# EasyEDA Pro project Type_C硬盘盒_2025-09-27_14-32-02.eprj, board PCB1_1
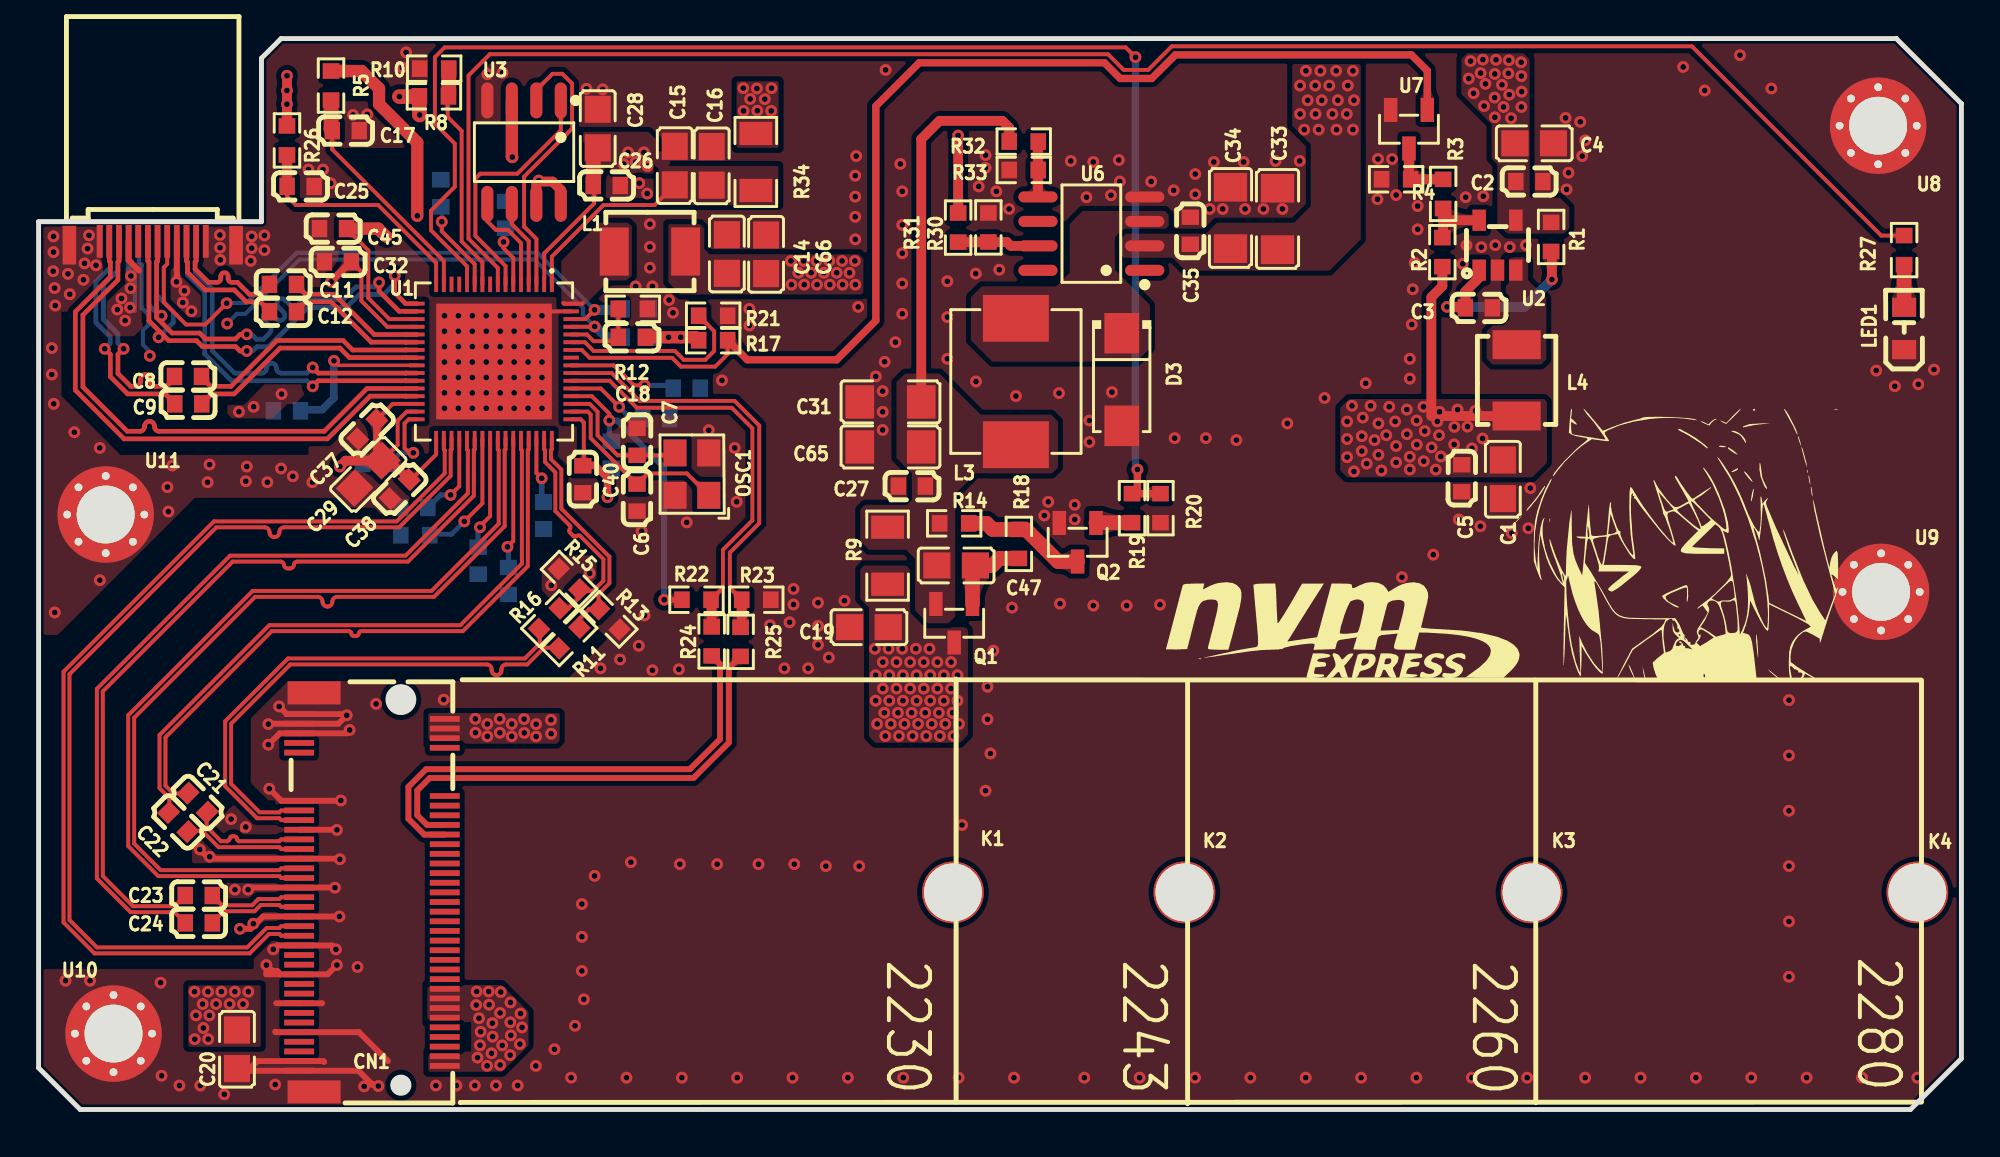
[diagram p4: board, top side]
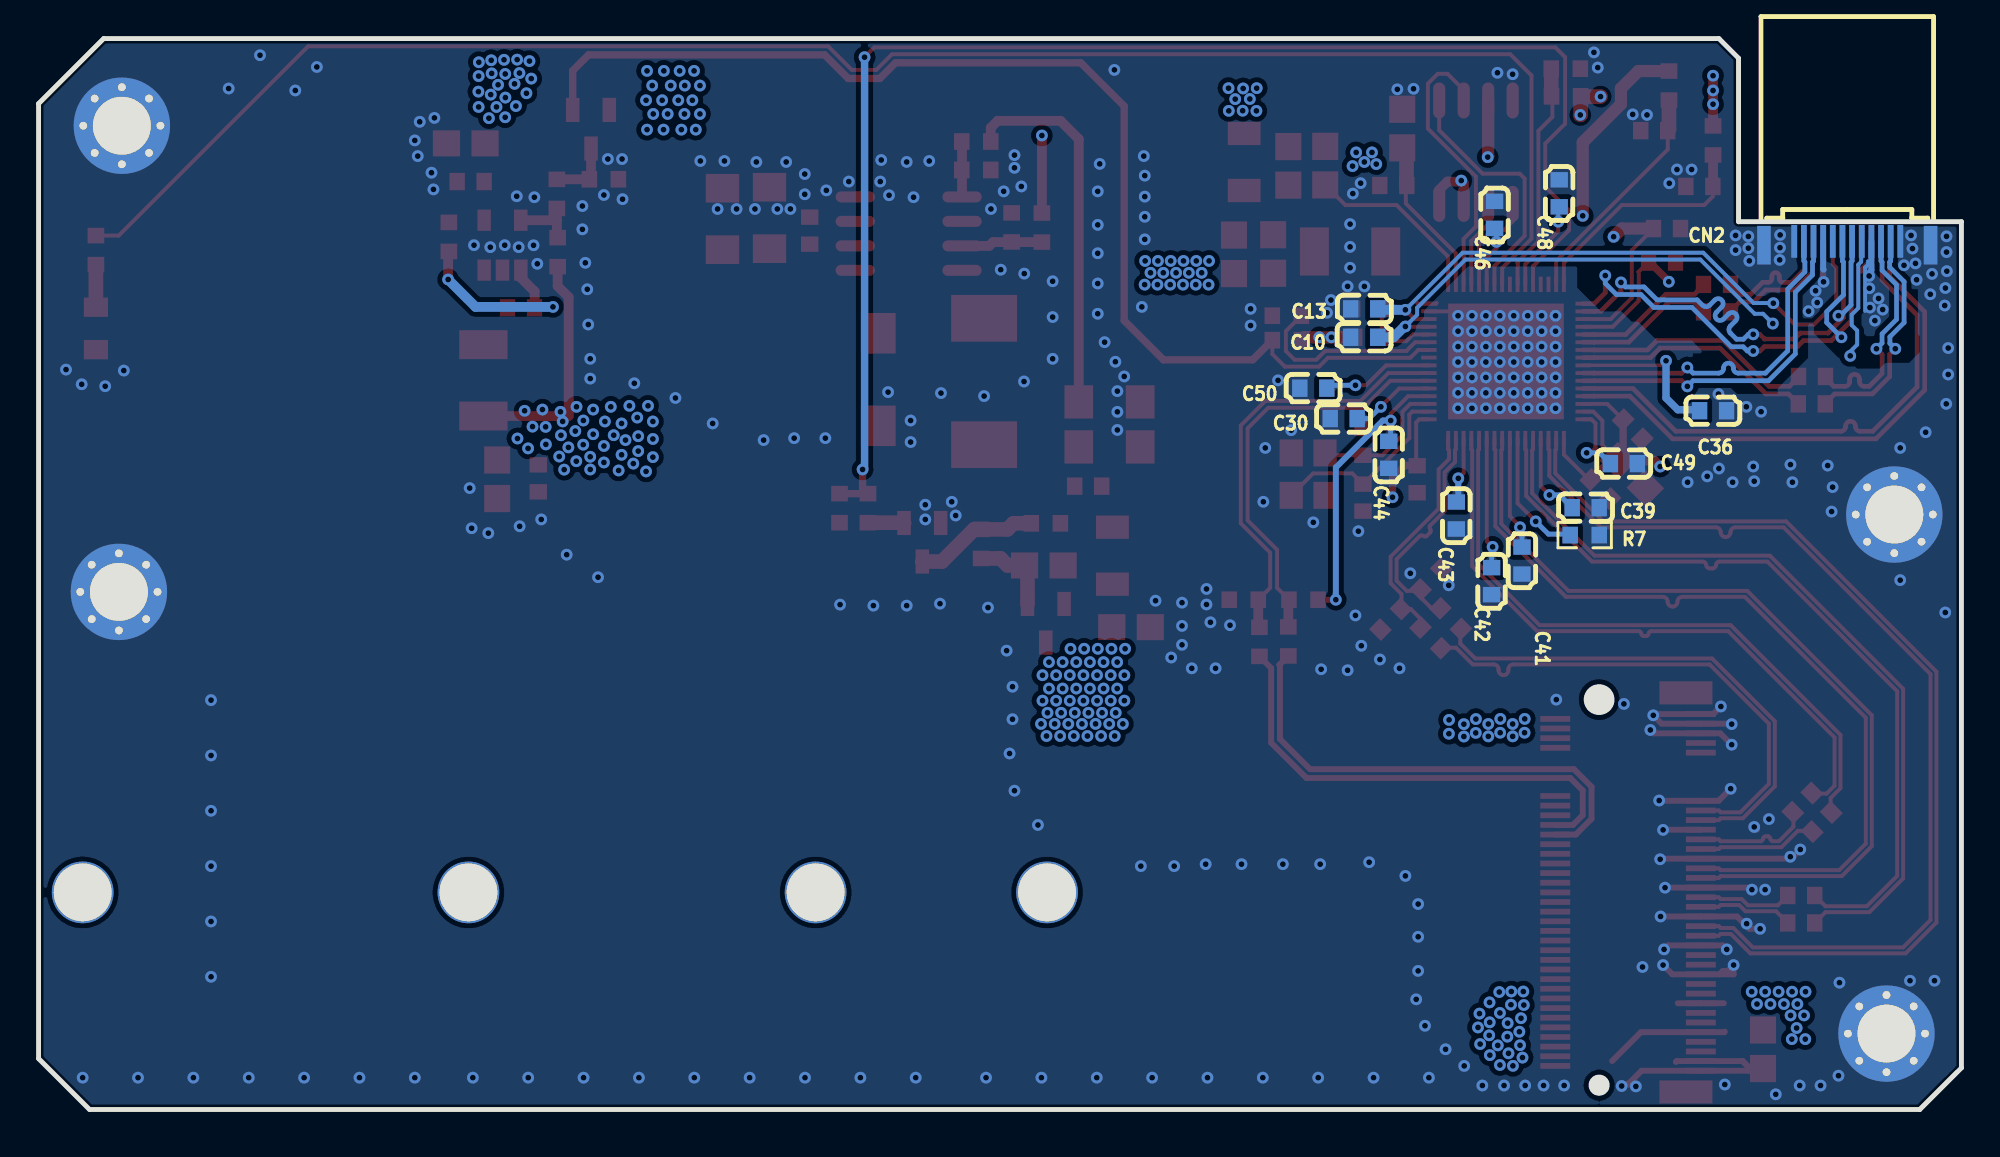
[diagram p5: board, bottom side, seen from below]

Outline 99.69 x 55.55 mm; copper layers: Top Layer, Inner1, Inner2, Bottom Layer. Coordinates in mm from the lower left corner of the outline.
Outline path: 0,46.05 11.56,46.05 11.56,54.53 12.57,55.55 96.32,55.55 99.69,52.17 99.69,2.64 97.05,0 2.16,0 0,2.16 0,46.05
Stack: Top Layer 0.035mm / Dielectric1 0.28mm PP er 4.5 / Inner1 0.035mm / Dielectric2 0.28mm FR4 er 4.5 / Inner2 0.035mm / Dielectric3 0.28mm PP er 4.5 / Bottom Layer 0.035mm

## Design rules (mm)
net REF_CLKP: REFCLK
net REF_CLKN: REFCLK
net $1N30478: MM2TX0
net $1N30420: MM2TX0
net P_RXP0: M2RX0
net P_RXN0: M2RX0
net $1N31175: MM2TX1
net $1N31117: MM2TX1
net P_RXP1: M2RX1
net P_RXN1: M2RX1
net U_RXP1: U3RX1
net U_RXN1: U3RX1
net DM: U2
net DP: U2
net $1N13574: TU3TX2
net $1N13608: TU3TX2
net $1N14258: TU3TX1
net $1N14292: TU3TX1
net U_RXN2: U3RX2
net U_RXP2: U3RX2
net CLKP: CLK
net CLKN: CLK
net P_TXP0: M2TX0
net P_TXN0: M2TX0
net P_TXP1: M2TX1
net P_TXN1: M2TX1
net U_TXP2: U3TX2
net U_TXN2: U3TX2
net U_TXN1: U3TX1
net U_TXP1: U3TX1
spacing safeClearance (default): track to track 0.152, other pairs 0.152 to 0.152
track width trackWidth (default): min 0.127, default 0.254, max 2.54
differential pair U3 (default): width min 0.241, default 0.241, max 0.241; gap min 0.152, default 0.152
differential pair M.2: width min 0.206, default 0.206, max 0.206; gap min 0.102, default 0.102
via viaSize (default): diameter min 0.5, default 0.61, max 10; hole min 0.3, default 0.305, max 6
net REF_CLKP uses M.2
net REF_CLKN uses M.2
net $1N30478 uses M.2
net $1N30420 uses M.2
net P_RXP0 uses M.2
net P_RXN0 uses M.2
net $1N31175 uses M.2
net $1N31117 uses M.2
net P_RXP1 uses M.2
net P_RXN1 uses M.2
net CLKP uses M.2
net CLKN uses M.2
net P_TXP0 uses M.2
net P_TXN0 uses M.2
net P_TXP1 uses M.2
net P_TXN1 uses M.2
diff pair REFCLK uses M.2
diff pair MM2TX0 uses M.2
diff pair M2RX0 uses M.2
diff pair MM2TX1 uses M.2
diff pair M2RX1 uses M.2
diff pair CLK uses M.2
diff pair M2TX0 uses M.2
diff pair M2TX1 uses M.2

## Placement (name value [footprint] x y rotation side)
C1  100nF  [C0805]  75.92 32.69 90 top
C2  104  [C0603]  77.29 48.13 0 top
C3  1uF  [C0603]  74.68 41.58 180 top
C4  100nF  [C0805]  77.55 50.11 180 top
C5  104  [C0603]  73.79 32.74 270 top
C6  33pF  [C0603]  31.03 31.74 90 top
C7  33pF  [C0603]  31.03 34.63 270 top
C8  104  [C0603]  7.75 38.02 0 top
C9  104  [C0603]  7.76 36.6 0 top
C10  330pF  [C0603]  30.96 40.06 180 bottom
C11  104  [C0603]  12.67 42.8 180 top
C12  104  [C0603]  12.67 41.38 180 top
C13  330pF  [C0603]  30.96 41.53 0 bottom
C14  100nF  [C0805]  35.69 44.37 270 top
C15  100nF  [C0805]  32.99 48.96 270 top
C16  100nF  [C0805]  34.9 48.95 270 top
C17  1uF  [C0603]  15.93 50.77 0 top
C18  1uF  [C0603]  30.76 40.06 180 top
C19  100nF  [C0805]  43.05 25.02 0 top
C20  100nF  [C0805]  10.29 3.12 90 top
C21  220nF  [C0603]  8.25 15.92 315 top
C22  220nF  [C0603]  7.24 14.91 315 top
C23  220nF  [C0603]  8.31 11.1 0 top
C24  220nF  [C0603]  8.31 9.68 0 top
C25  1uF  [C0603]  13.59 47.88 0 top
C26  104  [C0603]  29.46 47.93 0 top
C27  104  [C0603]  45.28 32.33 180 top
C28  100nF  [C0805]  28.99 50.88 270 top
C29  100nF  [C0805]  17.09 32.94 225 top
C30  104  [C0603]  32.03 35.84 180 bottom
C31  100uF  [C1206]  44.17 36.7 0 top
C32  104  [C0603]  15.52 43.97 180 top
C33  100uF  [C1206]  64.24 46.19 270 top
C34  100uF  [C1206]  61.8 46.24 270 top
C35  104  [C0603]  59.71 45.58 90 top
C36  104  [C0603]  12.88 36.25 180 bottom
C37  104  [C0603]  17.04 35.28 45 top
C38  104  [C0603]  18.72 32.18 225 top
C39  104  [C0603]  19.48 31.22 180 bottom
C40  104  [C0603]  28.22 32.69 270 top
C41  104  [C0603]  22.78 28.47 90 bottom
C42  104  [C0603]  24.36 27.41 90 bottom
C43  1uF  [C0603]  26.19 30.81 90 bottom
C44  104  [C0603]  29.69 33.96 90 bottom
C45  1uF  [C0603]  15.27 45.69 180 top
C46  104  [C0603]  24.21 46.41 90 bottom
C47  NC  [C0805]  47.57 28.22 180 top
C48  104  [C0603]  20.85 47.52 90 bottom
C49  104  [C0603]  17.5 33.5 180 bottom
C50  104  [C0603]  33.6 37.41 180 bottom
C65  100uF  [C1206]  44.17 34.37 0 top
C66  100nF  [C0805]  37.72 44.36 270 top
CN1  91302-32-067RDM  [CONN-SMD_91302-32-067RDM]  17.28 11.26 90 top
CN2  USB-307HE-B-SU  [USB-TYPE-C-SMD_USB-307HE-B-SU]  5.92 44.93 0 bottom
D3  SS54  [SMA_L4.3-W2.7-LS5.1-RD]  56.16 37.86 270 top
K1  -  [M3无外边]  47.41 11.26 0 top
K2  -  [M3无外边]  59.41 11.26 0 top
K3  -  [M3无外边]  77.41 11.26 0 top
K4  -  [M3无外边]  97.41 11.26 0 top
L1  4.7uH  [IND-SMD_L4.5-W4.0-1]  31.7 44.51 180 top
L3  1uH  [IND-SMD_L7.3-W6.6]  50.67 37.76 90 top
L4  4.7uH  [IND-SMD_L4.5-W4.0-1]  76.63 37.82 270 top
LED1  led0805  [LED0805-RD]  96.72 40.51 90 top
OSC1  25MHZ  [OSC-SMD_4P-L3.2-W2.5-BL]  33.87 32.96 90 top
Q1  NC  [SOT-23-3_L2.9-W1.3-P1.90-LS2.4-BR]  47.47 25.22 90 top
Q2  NC  [SOT-23-3_L2.9-W1.3-P1.90-LS2.4-BR]  53.87 29.42 90 top
R1  510K  [R0603]  78.42 45.26 90 top
R2  510K  [R0603]  72.78 44.47 90 top
R3  510K  [R0603]  72.82 47.49 90 top
R4  510K  [R0603]  70.39 48.25 180 top
R5  510K  [R0603]  15.16 53.11 90 top
R7  510K  [R0603]  19.53 29.79 180 bottom
R8  510K  [R0603]  20.5 52.55 180 top
R9  0  [R1206]  44.02 28.73 270 top
R10  510K  [R0603]  20.51 53.99 0 top
R11  510K  [R0603]  27.51 24.46 45 top
R12  510K  [R0603]  30.81 41.53 180 top
R13  510K  [R0603]  29.59 25.43 135 top
R14  NC  [R0603]  47.47 30.4 180 top
R15  510K  [R0603]  27.5 27.51 315 top
R16  510K  [R0603]  26.48 25.46 45 top
R17  510K  [R0603]  34.98 39.9 180 top
R18  NC  [R0603]  50.83 29.34 90 top
R19  NC  [R0603]  56.69 31.19 270 top
R20  NC  [R0603]  58.17 31.19 90 top
R21  510K  [R0603]  34.98 41.17 0 top
R22  510K  [R0603]  34.11 26.44 180 top
R23  510K  [R0603]  37.21 26.44 180 top
R24  510K  [R0603]  34.9 24.28 270 top
R25  510K  [R0603]  36.4 24.26 270 top
R26  510K  [R0603]  12.88 50.27 270 top
R27  510K  [R0603]  96.72 44.58 90 top
R30  100K  [R0603]  49.24 45.75 270 top
R31  100K  [R0603]  47.68 45.75 90 top
R32  6.2K  [R0603]  51.08 50.21 180 top
R33  3.6K  [R0603]  51.08 48.73 0 top
R34  NC  [R1206]  37.19 49.15 270 top
U1  JMS583  [QFN-64_L8.0-W8.0-P0.40-TL-EP6.0]  23.61 38.8 270 top
U2  RY3430  [TSOT-23-5_L2.9-W1.6-P0.95-LS2.8-BR]  75.64 44.83 270 top
U3  MX25L512EMI-10G  [SOP-8_L4.9-W3.9-P1.27-LS6.0-BL]  25.17 49.66 180 top
U6  TD1583  [SOP-8_L5.0-W4.0-P1.27-LS6.0-BL]  54.58 45.43 90 top
U7  NC  [SOT-23-3_L2.9-W1.3-P0.95-LS2.4-BR]  71.05 50.85 90 top
U8  -  [M3]  95.38 51.03 0 top
U9  -  [M3]  95.53 26.85 0 top
U10  -  [M3]  3.89 3.94 0 top
U11  -  [M3]  3.48 30.86 0 top

## Footprints (pads in the part's own frame, mm; a bottom-side part is the same pattern mirrored in y, then rotated)
C0603
  rect 0.8x0.9 smd: 1(-0.7,0) 2(0.7,0)
C0805
  rect 1.41x1.35 smd: 1(-1,0) 2(1,0)
C1206
  rect 1.486x1.727 smd: 1(-1.593,0) 2(1.593,0)
CONN-SMD_91302-32-067RDM
  rect 0.3x1.55 smd: 1(-9.25,3.775) 2(-9,-3.775) 3(-8.75,3.775) 4(-8.5,-3.775) 5(-8.25,3.775) 6(-8,-3.775) 7(-7.75,3.775) 8(-7.5,-3.775) 9(-7.25,3.775) 10(-7,-3.775) 11(-6.75,3.775) 12(-6.5,-3.775) 13(-6.25,3.775) 14(-6,-3.775) 15(-5.75,3.775) 16(-5.5,-3.775) 17(-5.25,3.775) 18(-5,-3.775) 19(-4.75,3.775) 20(-4.5,-3.775) 21(-4.25,3.775) 22(-4,-3.775) 23(-3.75,3.775) 24(-3.5,-3.775) 25(-3.25,3.775) 26(-3,-3.775) 27(-2.75,3.775) 28(-2.5,-3.775) 29(-2.25,3.775) 30(-2,-3.775) 31(-1.75,3.775) 32(-1.5,-3.775) 33(-1.25,3.775) 34(-1,-3.775) 35(-0.75,3.775) 36(-0.5,-3.775) 37(-0.25,3.775) 38(0,-3.775) 39(0.25,3.775) 40(0.5,-3.775) 41(0.75,3.775) 42(1,-3.775) 43(1.25,3.775) 44(1.5,-3.775) 45(1.75,3.775) 46(2,-3.775) 47(2.25,3.775) 48(2.5,-3.775) 49(2.75,3.775) 50(3,-3.775) 51(3.25,3.775) 52(3.5,-3.775) 53(3.75,3.775) 54(4,-3.775) 55(4.25,3.775) 56(4.5,-3.775) 57(4.75,3.775) 58(5,-3.775) 67(7.25,3.775) 68(7.5,-3.775) 69(7.75,3.775) 70(8,-3.775) 71(8.25,3.775) 72(8.5,-3.775) 73(8.75,3.775) 74(9,-3.775) 75(9.25,3.775)
  rect 1.2x2.75 smd: 76(-10.35,3) 76(10.35,3)
IND-SMD_L4.5-W4.0-1
  rect 1.5x2.5 smd: 1(-1.85,0) 2(1.85,0)
IND-SMD_L7.3-W6.6
  rect 2.424x3.42 smd: 1(3.278,0) 2(-3.278,0)
LED0805-RD
  rect 1x1.25 smd: 1(-1.1,0) 2(1.1,0)
M3
  round 0.6 hole 0.405x0.4: 1(-2,0) 1(-1.41,1.41) 1(-1.41,-1.41) 1(0,2) 1(0,-2) 1(1.41,1.41) 1(1.41,-1.41) 1(2,0)
  round 5 hole 3.005x3: 1(0,0)
M3无外边
  round 3.2 hole 3: 1(0,0)
OSC-SMD_4P-L3.2-W2.5-BL
  rect 1.4x1.2 smd: 1(-1.1,-0.875) 2(1.1,-0.875) 3(1.1,0.875) 4(-1.1,0.875)
QFN-64_L8.0-W8.0-P0.40-TL-EP6.0
  rect 0.8x0.2 smd: 1(-4,3) 2(-4,2.6) 3(-4,2.2) 4(-4,1.8) 5(-4,1.4) 6(-4,1) 7(-4,0.6) 8(-4,0.2) 9(-4,-0.2) 10(-4,-0.6) 11(-4,-1) 12(-4,-1.4) 13(-4,-1.8) 14(-4,-2.2) 15(-4,-2.6) 16(-4,-3) 33(4,-3) 34(4,-2.6) 35(4,-2.2) 36(4,-1.8) 37(4,-1.4) 38(4,-1) 39(4,-0.6) 40(4,-0.2) 41(4,0.2) 42(4,0.6) 43(4,1) 44(4,1.4) 45(4,1.8) 46(4,2.2) 47(4,2.6) 48(4,3)
  rect 0.2x0.8 smd: 17(-3,-4) 18(-2.6,-4) 19(-2.2,-4) 20(-1.8,-4) 21(-1.4,-4) 22(-1,-4) 23(-0.6,-4) 24(-0.2,-4) 25(0.2,-4) 26(0.6,-4) 27(1,-4) 28(1.4,-4) 29(1.8,-4) 30(2.2,-4) 31(2.6,-4) 32(3,-4) 49(3,4) 50(2.6,4) 51(2.2,4) 52(1.8,4) 53(1.4,4) 54(1,4) 55(0.6,4) 56(0.2,4) 57(-0.2,4) 58(-0.6,4) 59(-1,4) 60(-1.4,4) 61(-1.8,4) 62(-2.2,4) 63(-2.6,4) 64(-3,4)
  rect 6x6 smd: 65(0,0)
R0603
  rect 0.806x0.864 smd: 1(-0.753,0) 2(0.753,0)
R1206
  rect 1.208x1.701 smd: 1(-1.479,0) 2(1.479,0)
SMA_L4.3-W2.7-LS5.1-RD
  rect 2.1x1.801 smd: 1(-2.401,0) 2(2.401,0)
SOP-8_L4.9-W3.9-P1.27-LS6.0-BL
  oval 0.63x1.865 smd: 1(-1.905,-2.683) 2(-0.635,-2.683) 3(0.635,-2.683) 4(1.905,-2.683) 5(1.905,2.683) 6(0.635,2.683) 7(-0.635,2.683) 8(-1.905,2.683)
SOP-8_L5.0-W4.0-P1.27-LS6.0-BL
  oval 0.574x2.035 smd: 1(-1.905,-2.768) 2(-0.635,-2.768) 3(0.635,-2.768) 4(1.905,-2.768) 5(1.905,2.768) 6(0.635,2.768) 7(-0.635,2.768) 8(-1.905,2.768)
SOT-23-3_L2.9-W1.3-P0.95-LS2.4-BR
  rect 1.25x0.7 smd: 1(1,-0.95) 2(1,0.95) 3(-1,0)
SOT-23-3_L2.9-W1.3-P1.90-LS2.4-BR
  rect 1.25x0.7 smd: 1(1,-0.95) 2(1,0.95) 3(-1,0)
TSOT-23-5_L2.9-W1.6-P0.95-LS2.8-BR
  rect 1.1x0.7 smd: 1(1.294,-0.951) 2(1.294,-0.001) 3(1.294,0.951) 4(-1.294,0.951) 5(-1.294,-0.949)
USB-TYPE-C-SMD_USB-307HE-B-SU
  rect 0.299x1.7 smd far side: A1(2.751,-0.099) A2(2.251,-0.099) A3(1.75,-0.099) A4(1.25,-0.099) A5(0.752,-0.099) A6(0.252,-0.099) A7(-0.249,-0.099) A8(-0.75,-0.099) A9(-1.25,-0.099) A10(-1.75,-0.099) A11(-2.251,-0.099) A12(-2.748,-0.099)
  rect 0.299x1.7 smd: B1(-2.748,-0.099) B2(-2.251,-0.099) B3(-1.75,-0.099) B4(-1.25,-0.099) B5(-0.75,-0.099) B6(-0.249,-0.099) B7(0.252,-0.099) B8(0.752,-0.099) B9(1.25,-0.099) B10(1.75,-0.099) B11(2.251,-0.099) B12(2.751,-0.099)
  rect 0.701x1.999 smd: SH1(4.321,0.099) SH2(-4.321,0.099)
  rect 0.701x1.999 smd far side: SH3(-4.321,0.099) SH4(4.321,0.099)

## Nets
As in the schematic.

Pads without a net: CN1 5 6 7 8 10 11 13 17 19 20 22 23 24 25 26 28 30 32 34 36 38 40 42 44 46 48 54 56 58 67 68 69; CN2 A8 B8; K1 1; K2 1; K3 1; K4 1; U6 1 6 8

## Via types
v1: diameter 0.61, hole 0.305, Top Layer to Bottom Layer, 616 vias

## Routing (per net, layer and track width the routed paths; a pad name or vN(x,y) marks a point on that pad's centre or on a via; arc(x,y) is an arc through that point)
+1V: length 85.9
  Top Layer w0.178: U1.25 15.55,38.6 v1(15.32,38.84)
  Top Layer w0.203: v1(26.09,32.74) 25.81,33.02 U1.46 ; C29.1 18.62,34.47 18.62,35.73 19.08,36.2 U1.31 ; U1.40 23.41,30.78 22.89,30.25 v1(22.89,30.2) ; C40.1 28.27,33.44 28.27,35.64 28.11,35.8 U1.49 ; U1.20 18.08,40.6 16.74,41.94 16.74,43.45 C32.1 ; U1.53 29.15,37.4 v1(30.1,36.45) ; v1(21.36,31.88) 21.81,32.33 U1.36 ; U1.43 24.61,29.49 v1(24.31,29.18) ; 26.22,43.03 26.22,44.41 28.81,47 28.81,47.95 ; U1.30 18.36,36.6 C37.2 ; U1.33 20.61,33.97 19.32,32.68 C38.1
  Top Layer w0.381: 15.17,42.93 v1(15.17,42.94) 15.17,42.96 16.2,43.99 ; 28.21,33.41 28.84,33.41 29.5,32.76 v1(29.5,31.76) ; C38.1 18.24,33.65 C29.1 ; 17.75,33.71 17.54,33.91 C37.2
  Top Layer w0.508: 17.8,33.66 15.93,33.66 v1(15.62,33.35) ; R2.1 72.78,42.71 72.21,42.14 72.21,35.97 L4.2 ; C29.1 17.75,33.71
  Top Layer w0.762: 28.77,47.98 28.77,49.8 28.92,49.95
  Inner2 w0.508: v1(15.32,38.84) 15.17,38.98 v1(15.17,42.94)
  Bottom Layer w0.254: v1(30.1,36.45) 30.71,35.84 C30.2 ; v1(21.36,31.88) 20.84,31.88 C39.1 ; v1(22.89,30.2) 22.78,30.1 C41.2 ; C42.2 24.36,29.13 v1(24.31,29.18)
  Bottom Layer w0.305: v1(26.09,32.74) 26.09,31.61 C43.2
  Bottom Layer w0.381: C36.1 13.63,36.3 14.71,36.3 15.32,36.91 v1(15.32,38.84)
  vias: v1(30.34,49.04) v1(30.56,49.65) v1(30.96,49.15) v1(31.38,49.65) v1(31.57,48.93) v1(39.01,44.02) v1(39.03,42.79) v1(39.39,43.4) v1(39.67,44.02) v1(39.7,42.79) v1(40.06,43.4) v1(40.33,44.02) v1(40.36,42.79) v1(40.72,43.4) v1(41,44.02) v1(41.02,42.79) v1(41.38,43.4) v1(41.66,44.02) v1(41.69,42.79) v1(42.04,43.4) v1(42.32,44.02) v1(42.35,42.79) v1(67.84,35.69) v1(67.84,34.78) v1(67.84,33.84) v1(68.1,36.5) v1(68.2,33.1) v1(68.66,35.89) v1(68.61,34.93) v1(68.61,34.15) v1(68.86,33.5) v1(69.06,36.5) v1(69.27,34.72) v1(69.47,35.59) v1(69.47,33.96) v1(69.62,33.15) v1(69.88,34.98) v1(70.03,36.45) v1(70.33,35.69) v1(70.38,34.42) v1(70.38,33.56) v1(70.94,36.31) v1(70.94,35.03) v1(71.09,33.86) v1(71.09,33.2) v1(71.45,35.74) v1(71.46,34.48) v1(71.81,36.45) v1(71.87,35.19) v1(71.82,33.63) v1(72.23,34.34) v1(72.44,33.19) v1(72.52,35.69) v1(72.64,36.19) v1(72.61,34.97) v1(72.7,33.87) v1(73.41,35.41) v1(73.39,34.5) v1(73.57,36.31) v1(74.09,35.42) v1(74.32,34.29) v1(74.5,36.24) v1(74.87,34.81)
+3.3V: length 19.5
  Top Layer w0.508: R32.2 50.33,50.93 49.97,51.28 46.71,51.28 45.76,50.34 C31.2
AVDD33: length 61.9
  Top Layer w0.203: v1(24.11,45) 24.11,44.68 24.61,44.17 U1.6 ; v1(19.43,34.06) 19.23,34.06 18.97,34.32 18.97,35.59 19.19,35.8 U1.32 ; v1(29.59,35.74) 29.59,36.09 28.69,37 U1.52 ; U1.19 18.18,41 17.09,42.09 17.09,44.57 C45.1 ; U1.11 22.61,43.84 20.9,45.55 v1(20.9,46.05) ; U1.56 29.83,38.6 30.86,37.57 v1(31.42,37.57)
  Top Layer w0.305: R22.2 v1(32.44,26.44)
  Top Layer w0.508: U3.8 27.08,47.7 26.64,48.13 25.98,48.13 v1(25.93,48.18) 25.81,48.06 U3.7
  Top Layer w0.635: v1(19.63,46.36) 19.63,50.17 17.65,52.15 17.65,52.96 16.75,53.87 R5.2 ; C45.1 17.61,45.69 v1(18.03,45.27) ; U3.3 24.54,49.43 v1(24.56,49.4) ; C18.1 v1(32.66,40.06) v1(33.29,40.06) 34.07,40.06 R17.2
  Bottom Layer w0.203: v1(20.9,46.05) 20.9,46.77 C48.1
  Bottom Layer w0.254: v1(29.59,35.74) 29.59,34.76 C44.2 ; C50.2 32.75,37.57 v1(31.42,37.57) ; C46.1 24.11,45.61 v1(24.11,45) ; v1(19.43,34.06) 18.76,34.06 C49.1
  Bottom Layer w0.305: v1(32.44,26.44) 32.44,33.3 30,35.74 v1(29.59,35.74)
GND: length 70.6
  Top Layer w0.203: U1.63 26.21,41.4 U1.65
  Top Layer w0.305: v1(15.42,8.31) 15.21,8.51 CN1.27 12.37,8.51 v1(12.17,8.31) ; v1(8.36,13.49) 8.83,13.01 CN1.45 15.59,13.01 v1(15.62,12.98) ; 12.27,4.04 12.3,4.01 CN1.9 16.61,4.01 18.11,2.51 ; 10.93,2.1 10.94,2.1 11.35,2.51 ; 10.93,2.1 11.34,2.51 11.35,2.51 ; 10.93,2.1 11.01,2.01 CN1.1 16.58,2.01 17.3,1.3 ; v1(11.91,18.92) 12.5,19.51 CN1.71 15.95,19.51 v1(16.13,19.69) ; v1(15.47,14.5) 15.46,14.51 CN1.51 ; v1(11.96,16.64) 12.59,16.01 CN1.57 15.66,16.01 v1(15.67,16.03) ; 12.55,7.01 CN1.21 14.99,7.01 v1(15.47,7.49) ; 12.55,7.01 12.37,7.19 12.12,7.19 v1(11.81,7.49) 11.81,7.01 12.55,7.01 ; v1(10.74,14.66) 10.6,14.51 ; 15.62,10.03 v1(15.6,10.01) CN1.33 11.64,10.01 11,9.37 v1(10.44,9.37) ; v1(16.88,1.2) 16.98,1.3 17.3,1.3 ; 17.3,1.3 17.3,1.35 ; 12.32,5.51 CN1.15 14.71,5.51 ; v1(10.86,11.4) 10.97,11.51 CN1.39 15.36,11.51 v1(15.37,11.51) ; v1(12.47,20.9) 12.86,20.51 15.91,20.51 v1(15.98,20.45) 15.54,20.01 CN1.73 11.93,20.01 v1(11.91,19.99) ; 11.35,2.51 CN1.3 14.76,2.51 14.81,2.46
  vias: v1(0.76,43.48) v1(0.69,39.5) v1(0.69,38.13) v1(0.77,45.29) v1(0.77,44.47) v1(0.83,42.61) v1(0.86,41.7) v1(0.79,36.6) v1(0.84,25.78) v1(1.4,6.68) v1(1.52,43.34) v1(1.62,42.29) v1(1.85,35.13) v1(2.33,43.04) v1(2.38,43.89) v1(2.54,44.66) v1(2.61,45.34) v1(2.67,6.68) v1(2.98,43.79) v1(3.17,34.32) v1(3.17,27.46) v1(6.32,6.58) v1(6.38,1.75) v1(6.68,32.28) v1(6.73,31.01) v1(6.93,33.4) v1(7.3,1.24) v1(8.39,1.24) v1(8.76,32.54) v1(8.86,33.45) v1(8.87,13.11) v1(9.4,45.36) v1(9.41,44.7) v1(9.42,44.07) v1(9.63,0.79) v1(9.98,15.06) v1(10.18,11.4) v1(10.39,36.2) v1(10.74,32.59) v1(10.8,33.35) v1(11.05,45.29) v1(11.05,44.68) v1(11,44.02) v1(11.15,36.45) v1(11.14,9.64) v1(11.71,45.34) v1(11.71,44.58) v1(11.86,32.54) v1(12.27,1.3) v1(12.6,37.11) v1(12.57,33.25) v1(13.18,32.84) v1(13.99,48.76) v1(14.2,32.54) v1(14.75,48.76) v1(15.15,48.04) v1(16.3,51.59) v1(16.54,7.39) v1(17.04,51.62) v1(17.5,21.04) v1(17.62,1.22) v1(18.86,54.05) v1(19.05,54.83) v1(20.6,1.24) v1(21.04,41.17) v1(21.04,40.37) v1(21.04,39.57) v1(21.04,38.77) v1(21.04,37.97) v1(21.04,37.17) v1(21.04,36.37) v1(21.01,21.26) v1(21.67,1.24) v1(21.77,41.17) v1(21.77,40.37) v1(21.77,39.57) v1(21.77,38.77) v1(21.77,37.97) v1(21.77,37.17) v1(21.77,36.37) v1(22.49,41.17) v1(22.49,40.37) v1(22.49,39.57) v1(22.49,38.77) v1(22.49,37.97) v1(22.49,37.17) v1(22.49,36.37) v1(22.62,1.24) v1(23.21,41.17) v1(23.21,40.37) v1(23.21,39.57) v1(23.21,38.77) v1(23.21,37.97) v1(23.21,37.17) v1(23.21,36.37) v1(23.27,53.7) v1(23.71,1.24) v1(23.93,41.17) v1(23.93,40.37) v1(23.93,39.57) v1(23.93,38.77) v1(23.93,37.97) v1(23.93,37.17) v1(23.93,36.37) v1(24.06,53.78) v1(24.66,41.17) v1(24.66,40.37) v1(24.66,39.57) v1(24.66,38.77) v1(24.66,37.97) v1(24.66,37.17) v1(24.66,36.37) v1(24.84,1.24) v1(25.38,41.17) v1(25.38,40.37) v1(25.38,39.57) v1(25.38,38.77) v1(25.38,37.97) v1(25.38,37.17) v1(25.38,36.37) v1(25.78,2.26) v1(26.1,41.17) v1(26.1,40.37) v1(26.1,39.57) v1(26.1,38.77) v1(26.1,37.97) v1(26.1,37.17) v1(26.1,36.37) v1(26.58,27.19) v1(26.75,3.12) v1(27.61,1.65) v1(27.81,4.34) v1(28.17,10.66) v1(28.17,8.96) v1(28.17,7.19) v1(28.27,5.72) v1(28.41,52.94) v1(28.58,27.81) v1(28.83,12.12) v1(29.13,22.89) v1(29.25,52.92) v1(30.15,23.34) v1(30.48,1.65) v1(30.71,12.83) v1(30.95,42.69) v1(31.15,48.05) v1(31.11,24.05) v1(31.27,30) v1(31.42,25.63) v1(31.55,47.51) v1(31.7,45.93) v1(31.7,44.74) v1(31.7,43.66) v1(31.83,42.7) v1(31.83,22.78) v1(32.69,41.99) v1(32.89,41.33) v1(33.2,22.83) v1(33.25,12.73) v1(33.35,1.65) v1(33.6,30.45) v1(34.75,35.24) v1(35.18,12.73) v1(35.43,37.82) v1(36.09,34.32) v1(36.19,31.52) v1(36.22,1.65) v1(36.86,41.53) v1(36.86,40.67) v1(37.33,12.73) v1(37.92,25.12) v1(38.67,22.89) v1(38.94,25.27) v1(39.14,27) v1(39.14,26.19) v1(39.09,1.65) v1(39.18,12.73) v1(39.9,22.89) v1(40.41,26.29) v1(40.41,25.08) v1(40.41,24.1) v1(40.82,12.62) v1(40.97,23.44) v1(41.78,26.39) v1(41.96,1.65) v1(42.34,48.44) v1(42.34,47.35) v1(42.34,46.3) v1(42.34,45.14) v1(42.39,49.45) v1(42.49,41.63) v1(42.55,12.62) v1(43.41,38.02) v1(43.76,37.26) v1(43.76,36.19) v1(43.76,35.25) v1(43.87,38.79) v1(43.92,53.92) v1(44.42,39.8) v1(44.68,49.05) v1(44.78,47.62) v1(44.78,45.89) v1(44.78,44.41) v1(44.78,42.84) v1(44.78,41.28) v1(44.83,1.65) v1(47.12,42.96) v1(47.12,41.1) v1(47.12,38.94) v1(47.7,1.65) v1(47.88,14.76) v1(48.59,43.36) v1(48.6,37.76) v1(48.74,47.88) v1(49.1,49.51) v1(49.1,48.84) v1(49.1,16.54) v1(49.2,21.93) v1(49.2,20.24) v1(49.35,18.47) v1(49.5,23.8) v1(49.66,47.62) v1(49.81,43.56) v1(50.32,46.71) v1(50.47,26.04) v1(50.57,1.65) v1(50.67,37.01) v1(52.15,30.81) v1(52.35,31.52) v1(52.91,37.16) v1(52.96,26.24) v1(53.52,49.2) v1(53.72,31.37) v1(53.72,30.61) v1(54.22,1.65) v1(54.33,47.32) v1(54.48,35.74) v1(54.48,34.62) v1(54.69,49.15) v1(54.69,26.14) v1(55.6,47.42) v1(55.65,37.21) v1(56.01,49.25) v1(56.06,48.13) v1(56.41,26.14) v1(57.09,1.65) v1(57.69,48.13) v1(58.14,26.19) v1(58.85,47.68) v1(58.9,34.82) v1(59.96,1.65) v1(59.97,48.52) v1(59.97,47.47) v1(60.52,34.82) v1(60.72,46.71) v1(60.93,49.15) v1(61.39,46.71) v1(62.1,34.72) v1(62.48,49.15) v1(62.55,46.71) v1(62.83,1.65) v1(63.51,46.71) v1(64.13,49.2) v1(64.49,46.71) v1(64.74,35.59) v1(65.38,49.2) v1(65.7,1.65) v1(66.68,36.91) v1(68.57,1.65) v1(68.81,37.67) v1(69.44,49.3) v1(69.42,47.22) v1(70.18,49.3) v1(70.39,47.43) v1(70.69,27.61) v1(71.09,38.94) v1(71.09,37.91) v1(71.25,42.55) v1(71.2,40.72) v1(71.35,43.92) v1(71.44,1.65) v1(71.5,46.86) v1(71.5,45.66) v1(72.31,28.78) v1(73.63,30.61) v1(73.84,43.87) v1(73.99,47.32) v1(74.03,44.83) v1(74.31,1.65) v1(74.75,30.25) v1(74.8,44.73) v1(74.9,47.37) v1(75.53,44.83) v1(76.28,44.73) v1(76.38,29.9) v1(77.12,44.83) v1(77.24,30.15) v1(77.18,1.65) v1(77.34,32.23) v1(79.17,51.44) v1(79.22,47.73) v1(79.32,48.59) v1(79.93,51.23) v1(80.04,49.45) v1(80.19,50.27) v1(80.19,1.65) v1(83.06,1.65) v1(85.27,54.08) v1(85.93,1.65) v1(86.39,52.86) v1(88.21,54.69) v1(88.8,1.65) v1(89.84,52.96) v1(90.75,21.23) v1(90.75,18.36) v1(90.75,15.49) v1(90.75,12.62) v1(90.75,9.75) v1(90.75,6.88) v1(91.67,1.65) v1(94.54,1.65) v1(95.28,38.33) v1(96.24,37.52) v1(97.46,37.62) v1(97.41,1.65) v1(98.27,38.38)
VBUS_IN: length 12.4
  Top Layer w0.203: C25.1 12.89,47.36 13.33,46.91 17.61,46.91 20.61,43.91 U1.16
  Top Layer w0.508: C25.1 12.88,47.89 R26.2
VDDREG: length 9.4
  Top Layer w0.203: U1.1 26.61,44.24 29.29,46.91 31.94,46.91 C15.2
CC1: length 31.7
  Top Layer w0.203: U1.62 28.35,41 v1(28.83,41.48) ; CN2.A5 6.67,43.86 6.49,43.68 6.49,41.87 7.65,40.72 8.65,40.72 v1(9.75,41.82)
  Bottom Layer w0.203: v1(28.83,41.48) 25.86,44.44 13.39,44.44 10.78,41.83 9.76,41.83 v1(9.75,41.82)
  Bottom Layer w0.508: C13.1 30.21,41.48 v1(28.83,41.48)
CC2: length 35.9
  Top Layer w0.203: U1.61 28.81,40.6 v1(28.83,40.61)
  Inner2 w0.203: v1(5.77,39.09) 6.73,39.09 7.75,40.11 9.12,40.11 v1(9.78,40.77)
  Bottom Layer w0.203: 5.2,44.86 5.2,43.97 5.34,43.83 5.35,43.8 5.35,41.57 5.69,41.23 5.69,40.69 5.41,40.4 5.41,39.67 5.77,39.31 v1(5.77,39.09) ; v1(9.78,40.77) 10.29,41.28 10.72,41.28 13.53,44.09 25.72,44.09 28.22,41.59 28.22,41.22 v1(28.83,40.61)
  Bottom Layer w0.508: C10.2 29.44,40.06 28.88,40.61 v1(28.83,40.61)
CLKN: length 12.1
  Top Layer w0.205: U1.47 26.21,34.25 26.26,34.2 26.26,33.58 26.79,33.05 26.79,31.04 27.54,30.29 arc(27.58,30.2) 27.54,30.11 arc(27.51,30.02) 27.54,29.93 27.72,29.75 arc(27.81,29.71) 27.9,29.75 arc(27.99,29.79) 28.08,29.75 29.29,28.55 29.29,27.43 28.76,26.9 28.12,26.9 28.04,26.98 28.04,26.56 27.47,25.99 27.02,25.99
CLKP: length 12
  Top Layer w0.205: R11.2 28.04,25.45 28.55,25.96 R13.2 29.03,25.98 29.03,26.74 29.59,27.3 29.59,28.67 27.1,31.17 27.1,33.2 26.57,33.73 26.57,34.2 26.61,34.25 U1.48
DM: length 27.3
  Top Layer w0.241: U1.17 19.04,41.8 19.04,41.8 18.47,42.37 v1(18.47,43.26) ; CN2.A7 5.67,44.01 5.72,43.96 5.72,40.91 6.75,39.88 8.19,39.88 8.49,39.57 10.21,39.57 10.44,39.34 v1(10.8,39.34)
  Bottom Layer w0.241: v1(18.47,43.26) 18.47,42.85 17.89,42.27 16.62,42.27 15.95,41.6 13.97,41.6 11.93,39.56 11.32,39.56 11.1,39.34 v1(10.8,39.34) ; v1(6.22,40.06) 6.98,40.82 6.98,41.38 6.12,42.25 6.12,43.96 6.17,44.01 CN2.B7
DP: length 27.2
  Top Layer w0.241: U1.18 19.04,41.4 19.04,41.4 18.7,41.4 17.65,42.45 v1(17.65,42.9) ; v1(10.8,40.21) 10.45,40.21 10.21,39.97 8.66,39.97 8.35,40.28 6.92,40.28 6.12,41.08 6.12,43.96 6.17,44.01 CN2.A6
  Bottom Layer w0.241: v1(10.8,40.21) 11.05,40.21 11.3,39.95 11.66,39.95 11.98,40.28 arc(12.06,40.46) 11.98,40.64 11.71,40.91 arc(11.71,41.27) 12.07,41.27 12.34,41 arc(12.7,41) 12.7,41.36 12.43,41.63 arc(12.43,41.99) 12.79,41.99 13.06,41.71 arc(13.24,41.64) 13.42,41.71 13.7,42 15.78,42 16.45,42.67 17.42,42.67 v1(17.65,42.9) ; v1(6.38,41.17) 6.27,41.17 5.72,41.72 5.72,43.96 5.67,44.01 CN2.B6
GPIO0: length 14.7
  Top Layer w0.203: U3.2 25.81,52.88 26.64,53.72 27.15,53.72 27.66,53.21 27.66,50.88 25.17,48.39 25.17,45.8 25.81,45.16 U1.3
GPIO1: length 4.5
  Top Layer w0.203: U1.4 25.41,45.05 24.54,45.92 U3.6
GPIO2: length 5.3
  Top Layer w0.203: U1.5 25.01,44.95 24.33,45.63 23.71,45.63 23.27,46.07 U3.5
GPIO3: length 13.1
  Top Layer w0.203: U1.7 24.21,43.75 22.65,45.32 22.65,48.29 22.9,48.54 24.82,48.54 27.08,50.8 U3.1
GPIO4: length 91.3
  Top Layer w0.203: R27.2 95.54,45.33 85.72,55.15 58.76,55.15 57.53,53.92 56.26,53.92 55.45,54.74 23.39,54.74 22.29,53.63 22.29,45.17 23.81,43.65 U1.8
GPIO6: length 11.9
  Top Layer w0.203: U1.10 23.01,43.95 21.94,45.02 21.94,50.76 21.21,51.49 21.21,52.51
  Top Layer w0.762: R10.2 21.27,52.57 R8.1
GPIO7: length 74.5
  Top Layer w0.203: U1.12 22.21,43.74 20.34,45.61 20.34,46.62 21.58,47.86 21.58,50.1 20.55,51.13 20.55,54.58 21.06,55.09 56.36,55.09 v1(56.87,54.58)
  Top Layer w0.381: v1(56.97,33.2) 56.97,32.22 56.69,31.94 58.17,31.94
  Bottom Layer w0.381: v1(56.97,33.2) 56.87,33.3 v1(56.87,54.58)
LXO: length 1
  Top Layer w0.203: 27.2,41.83 27.24,41.8 U1.64 28.18,41.8 28.22,41.83
M.2+3.3V:
  vias: v1(8.08,6.11) v1(8.16,4.88) v1(8.1,3.65) v1(8.51,5.47) v1(8.55,4.23) v1(8.78,6.11) v1(8.86,4.88) v1(8.79,3.65) v1(9.2,5.47) v1(9.48,6.11) v1(9.9,5.47) v1(10.18,6.11) v1(10.6,5.47) v1(10.87,6.11) v1(22.64,20.26) v1(22.65,19.54) v1(22.72,6.12) v1(22.69,5.42) v1(22.76,2.69) v1(22.83,4.74) v1(22.92,4.03) v1(22.89,3.33) v1(23.27,20) v1(23.27,19.36) v1(23.25,2.27) v1(23.34,6.12) v1(23.36,5.44) v1(23.53,4.48) v1(23.54,3.78) v1(23.48,2.91) v1(23.91,20.26) v1(23.92,19.54) v1(23.96,6.09) v1(23.93,5.01) v1(23.93,2.31) v1(24.04,3.33) v1(24.47,5.56) v1(24.46,4.52) v1(24.45,2.82) v1(24.53,20) v1(24.53,19.36) v1(24.48,3.85) v1(24.95,3.39) v1(24.99,4.97) v1(25.06,4.26) v1(25.17,20.25) v1(25.18,19.53) v1(25.8,19.99) v1(25.8,19.35) v1(26.57,20.21) v1(26.57,19.49) v1(43.36,23.9) v1(43.4,22.53) v1(43.4,21.21) v1(43.48,20) v1(43.77,23.21) v1(43.77,21.83) v1(43.85,20.58) v1(43.9,19.37) v1(44.07,23.9) v1(44.11,22.53) v1(44.11,21.21) v1(44.18,20) v1(44.48,23.21) v1(44.48,21.83) v1(44.56,20.58) v1(44.61,19.37) v1(44.78,23.9) v1(44.81,22.53) v1(44.81,21.21) v1(44.89,20) v1(45.19,23.21) v1(45.19,21.83) v1(45.26,20.58) v1(45.31,19.37) v1(45.48,23.9) v1(45.52,22.53) v1(45.52,21.21) v1(45.6,20) v1(45.89,23.21) v1(45.89,21.83) v1(45.97,20.58) v1(46.02,19.37) v1(46.19,23.9) v1(46.23,22.53) v1(46.23,21.21) v1(46.31,20) v1(46.6,23.21) v1(46.6,21.83) v1(46.68,20.58) v1(46.73,19.37) v1(46.94,22.53) v1(46.94,21.21) v1(47.01,20) v1(47.31,23.21) v1(47.31,21.83) v1(47.39,20.58) v1(47.44,19.37) v1(47.64,22.53) v1(47.64,21.21) v1(47.72,20)
MODE0: length 62.3
  Top Layer w0.203: R17.1 35.73,39.18 35.08,38.53 33.3,38.53 32.85,38.99 28.57,38.99 28.16,39.4 U1.58
  Top Layer w0.381: R17.1 36.75,38.89 41.38,38.89 43.41,40.92 43.41,52.04 45.66,54.29 55.26,54.29 56.08,53.48 57.72,53.48 58.94,54.7 71.18,54.7 72,53.88 U7.1
MODE1: length 10.1
  Top Layer w0.203: U1.59 28.32,39.8 28.78,39.34 32.99,39.34 33.45,38.89 34.57,38.89 35.03,39.34 35.03,40.37 R21.1
P_RXN0: length 44.1
  Top Layer w0.205: CN1.41 12.58,12.01 12.48,12.11 6.2,12.11 4.65,13.66 4.65,20.45 11.1,26.9 20.38,26.9 23.86,30.38 23.86,34.2 23.81,34.25 U1.41
P_RXN1: length 52.2
  Top Layer w0.205: CN1.29 12.58,9.01 12.48,9.11 11.95,9.11 10.94,8.1 2.9,8.1 1.3,9.7 1.3,22.71 9.09,30.51 18.57,30.51 21.06,33 21.06,34.2 21.01,34.25 U1.34
P_RXP0: length 44.2
  Top Layer w0.205: U1.42 24.21,34.25 24.17,34.2 24.17,30.25 20.5,26.59 15.48,26.59 arc(15.31,26.52) 15.23,26.34 arc(15.16,26.16) 14.98,26.09 ; CN1.43 12.58,12.51 12.48,12.41 6.33,12.41 4.96,13.79 4.96,20.32 11.23,26.59 14.47,26.59 arc(14.65,26.52) 14.72,26.34 arc(14.8,26.16) 14.98,26.09
P_RXP1: length 52.3
  Top Layer w0.205: U1.35 21.41,34.25 21.37,34.2 21.37,32.87 18.69,30.2 12.73,30.2 arc(12.56,30.12) 12.48,29.95 arc(12.41,29.77) 12.23,29.69 ; CN1.31 12.58,9.51 12.48,9.41 11.82,9.41 10.82,8.41 3.02,8.41 1.6,9.83 1.6,22.58 9.22,30.2 11.72,30.2 arc(11.9,30.12) 11.97,29.95 arc(12.05,29.77) 12.23,29.69
P_TXN0: length 33.2
  Top Layer w0.205: C22.1 6.78,15.44 6.78,16.16 6.27,16.67 6.27,19.43 11.96,25.12 21.87,25.12 25.06,28.31 25.06,34.2 25.01,34.25 U1.44
P_TXN1: length 41.7
  Top Layer w0.205: C24.1 7.05,10.23 4.77,10.23 3.02,11.99 3.02,21.82 9.93,28.73 19.02,28.73 22.26,31.96 22.26,34.2 22.21,34.25 U1.37
P_TXP0: length 33.3
  Top Layer w0.205: C21.1 7.72,16.38 6.99,16.38 6.58,16.8 6.58,19.3 12.09,24.81 16.09,24.81 arc(16.18,24.78) 16.22,24.69 arc(16.25,24.6) 16.34,24.56 16.47,24.56 arc(16.56,24.6) 16.6,24.69 arc(16.64,24.78) 16.73,24.81 22,24.81 25.37,28.18 25.37,34.2 25.41,34.25 U1.45
P_TXP1: length 41.6
  Top Layer w0.205: C23.1 7.05,10.54 4.9,10.54 3.33,12.11 3.33,21.69 10.06,28.42 12.55,28.42 arc(12.67,28.37) 12.72,28.24 arc(12.78,28.12) 12.9,28.07 13.06,28.07 arc(13.18,28.12) 13.23,28.24 arc(13.28,28.37) 13.41,28.42 19.15,28.42 22.57,31.83 22.57,34.2 22.61,34.25 U1.38
PCIE_CLKREQ: length 22.3
  Top Layer w0.203: R23.2 35.84,27.06 35.84,28.89 37.36,30.41 37.36,35.48 36.09,36.75 31.16,36.75 29.72,38.2 U1.55
  Top Layer w0.508: R25.1 36.46,25.07 R23.2
PCIE_RST: length 21.6
  Top Layer w0.203: R22.1 35.48,27.06 35.48,29.03 37.01,30.56 37.01,35.33 35.94,36.4 31.01,36.4 29.61,37.8 U1.54
  Top Layer w0.508: R22.1 34.9,26.41 R24.1
REF_CLKN: length 26.7
  Top Layer w0.205: CN1.53 12.58,15.01 12.48,15.11 11.33,15.11 9.67,16.76 9.67,20.14 12.93,23.39 25.21,23.39 25.98,24.17 25.98,24.9 25.95,24.93
REF_CLKP: length 26.6
  Top Layer w0.205: R11.1 26.95,23.95 26.2,23.95 25.34,23.09 24.25,23.09 arc(24.07,23.01) 24,22.83 24,22.78 arc(23.74,22.53) 23.49,22.78 23.49,22.83 arc(23.42,23.01) 23.24,23.09 13.06,23.09 9.98,20.01 9.98,16.89 11.46,15.41 12.48,15.41 12.58,15.51 CN1.55
RST: length 12
  Top Layer w0.203: C17.1 15.23,49.8 21.01,44.01 U1.15
  Top Layer w0.762: C17.1 15.16,50.84 R5.1
TME: length 4.3
  Top Layer w0.203: R12.2 30.06,40.06 ; 30.06,40.06 C18.2 29.86,39.85 28.78,39.85 28.43,40.2 U1.60 ; 30.06,40.06 29.92,40.2
U_RXN1: length 18.1
  Top Layer w0.241: U1.27 19.04,37.8 19.04,37.8 14.5,37.8 v1(14.21,37.51)
  Bottom Layer w0.241: 7.67,45.03 7.67,44.01 7.72,43.96 7.72,43.28 8.61,42.39 8.61,39.19 10,37.8 13.92,37.8 v1(14.21,37.51)
U_RXN2: length 28.1
  Top Layer w0.241: CN2.A10 4.17,44.01 4.11,43.96 4.11,43.03 2.3,41.21 2.3,37.48 4.6,35.18 5.24,35.18 arc(5.42,35.25) 5.5,35.43 5.5,35.44 arc(5.75,35.7) 6,35.44 6,35.43 arc(6.08,35.25) 6.26,35.18 14.81,35.18 17.03,37.4 19.04,37.4 19.04,37.4 U1.28
U_RXP1: length 18
  Top Layer w0.241: U1.26 19.04,38.2 19.04,38.2 14.5,38.2 v1(14.21,38.49)
  Bottom Layer w0.241: CN2.B11 8.17,44.01 8.12,43.96 8.12,43.45 9.01,42.56 9.01,39.35 10.16,38.2 11.57,38.2 arc(11.75,38.27) 11.82,38.45 11.82,38.46 arc(12.08,38.71) 12.33,38.46 12.33,38.45 arc(12.41,38.27) 12.59,38.2 13.92,38.2 v1(14.21,38.49)
U_RXP2: length 28.2
  Top Layer w0.241: U1.29 19.04,37 19.04,37 17.19,37 14.97,34.79 4.43,34.79 1.91,37.31 1.91,41.38 3.72,43.19 3.72,43.96 3.67,44.01 CN2.A11
U_TXN1: length 7.3
  Top Layer w0.241: U1.22 19.04,39.8 19.04,39.8 17.25,39.8 15.16,41.89 13.85,41.89 13.37,41.42 C12.1
U_TXN2: length 12.6
  Top Layer w0.241: C8.2 8.45,37.98 8.92,37.51 9.98,37.51 12.36,39.89 15.79,39.89 16.28,39.4 19.04,39.4 19.04,39.4 U1.23
U_TXP1: length 7.3
  Top Layer w0.241: U1.21 19.04,40.2 19.04,40.2 17.41,40.2 15.32,42.29 13.85,42.29 13.37,42.76 C11.1
U_TXP2: length 12.6
  Top Layer w0.241: C9.2 8.97,37.12 10.14,37.12 12.52,39.5 15.62,39.5 16.12,39 19.04,39 19.04,39 U1.24
USB5V: length 17.8
  Top Layer w0.305: 7.19,43.26 7.17,43.28 CN2.A4 ; CN2.A9 4.67,44.05 5.21,43.51
  Top Layer w0.508: R31.2 v1(47.68,50.52) ; v1(12.88,53.62) v1(12.88,52.86) v1(12.88,52.15) R26.1
  Top Layer w0.762: v1(19.76,51.59) 19.74,51.6 R8.2 19.73,52.54 v1(18.71,52.54)
  Bottom Layer w0.203: 4.84,44 4.84,43.82 4.99,43.67 4.99,41.42
  Bottom Layer w0.305: 7.14,43.56 7.17,43.59 CN2.A4 ; 4.7,43.51 4.67,43.54 CN2.A9
  vias: v1(4.08,41.49) v1(4.3,42.07) v1(4.49,40.92) v1(4.74,41.6) v1(4.79,43.24) v1(4.77,42.6) v1(7.15,42.93) v1(7.56,42.47) v1(7.48,41.86) v1(7.92,41.41) v1(36.54,52.98) v1(36.55,51.8) v1(36.89,52.42) v1(37.24,52.96) v1(37.27,51.81) v1(37.65,52.41) v1(38,52.98) v1(37.99,51.8) v1(65.41,53.11) v1(65.41,51.64) v1(65.62,50.83) v1(65.71,53.87) v1(65.8,52.35) v1(66.19,53.11) v1(66.21,51.64) v1(66.37,50.83) v1(66.46,53.87) v1(66.53,52.35) v1(66.92,53.11) v1(67.08,51.64) v1(67.28,53.87) v1(67.36,52.35) v1(67.29,50.83) v1(67.83,51.64) v1(67.88,53.11) v1(68.15,53.87) v1(68.15,50.83) v1(68.2,52.35) v1(74.15,53.47) v1(74.24,54.38) v1(74.4,52.71) v1(74.76,53.76) v1(74.88,54.46) v1(74.95,52.05) v1(75.02,53.2) v1(75.56,54.45) v1(75.5,53.71) v1(75.49,52.49) v1(75.5,51.47) v1(75.87,53.15) v1(75.96,52) v1(76.23,54.42) v1(76.2,53.74) v1(76.25,52.64) v1(76.35,51.42) v1(76.87,54.32) v1(76.88,53.6) v1(76.89,52.8) v1(76.88,52)
XIN: length 10.1
  Top Layer w0.203: U1.50 28.47,36.2 28.63,36.05 28.63,34.82 31.01,32.44 C6.2 31.58,32.99 33.61,32.99 OSC1.1
XOUT: length 7.3
  Top Layer w0.203: OSC1.3 32.87,33.93 C7.2 30.02,33.93 28.98,34.97 28.98,36.2 28.58,36.6 U1.51
$1N4207: length 4.2
  Top Layer w0.508: U6.7 50.4,44.8 50.21,44.99 R31.1
$1N4210: length 2.9
  Top Layer w0.508: U6.5 51.82,50.19 R32.1
$1N6130: length 3.3
  Top Layer w0.508: U7.3 71.05,48.34 R4.1 72.82,48.25 R3.2
$1N6159: length 3.4
  Top Layer w0.508: R2.2 72.82,45.27 72.82,46.1 ; 72.82,46.1 R3.1 ; 72.82,46.1 72.85,46.13 U2.5
$1N7264: length 6.5
  Top Layer w0.762: Q2.3 52.86,28.42 51.19,30.09 R18.2 49.46,30.09 49.15,30.4 R14.1
$1N7265: length 4.5
  Top Layer w0.762: R18.1 49.82,28.58 49.45,28.22 C47.1 48.42,28.07 Q1.1
$1N7717: length 1.9
  Top Layer w0.762: R19.2 54.84,30.44 Q2.1
$1N13574: length 12
  Top Layer w0.241: v1(4.41,39.46) 4.11,39.17 4.11,38.18 4.78,37.51 5.03,37.51 arc(5.21,37.58) 5.29,37.76 5.29,37.88 arc(5.54,38.13) 5.79,37.88 5.79,37.76 arc(5.87,37.58) 6.05,37.51 6.62,37.51 7.05,37.93 C8.1
  Bottom Layer w0.241: CN2.B3 4.17,44.01 4.11,43.96 4.11,43.53 3.37,42.78 3.37,40.98 4.11,40.23 4.11,39.75 v1(4.41,39.46)
$1N13608: length 11.8
  Top Layer w0.241: v1(3.43,39.46) 3.72,39.17 3.72,38.01 4.62,37.12 6.57,37.12 7.06,36.63 C9.1
  Bottom Layer w0.241: CN2.B2 3.67,44.01 3.72,43.96 3.72,43.69 2.97,42.94 2.97,40.82 3.71,40.08 3.71,39.74 v1(3.43,39.46)
$1N14258: length 6.8
  Top Layer w0.241: C11.2 11.97,42.76 11.5,42.29 10.93,42.29 10.31,42.91 10.02,42.91 arc(9.88,42.96) 9.83,43.1 9.83,43.22 arc(9.64,43.41) 9.45,43.22 9.45,43.1 arc(9.39,42.96) 9.26,42.91 8.81,42.91 8.12,43.6 8.12,43.96 8.17,44.01 CN2.A2
$1N14292: length 6.7
  Top Layer w0.241: 7.67,45.03 7.67,44.01 7.72,43.96 7.72,43.44 8.65,42.51 10.15,42.51 10.77,41.89 11.5,41.89 11.97,41.42 C12.2
$1N19815: length 6.3
  Top Layer w0.203: v1(22.07,30.51) 23.01,31.44 U1.39
  Bottom Layer w0.254: 20.75,29.84 21.41,29.84 v1(22.07,30.51)
$1N26384: length 25.6
  Top Layer w0.305: R24.2 35.36,23.06 35.33,23.08 35.33,19.21 33.77,17.65 20.09,17.65 19.18,16.74 19.18,15.08 19.99,14.26 CN1.50
$1N26518: length 24.8
  Top Layer w0.305: R25.2 35.79,22.89 35.79,19.02 33.96,17.2 20.28,17.2 19.63,16.55 19.63,15.27 20.14,14.76 CN1.52
$1N30420: length 6.2
  Top Layer w0.205: CN1.47 12.58,13.51 12.48,13.61 9.33,13.61 8.49,14.45 7.77,14.45 C22.2
$1N30478: length 6.2
  Top Layer w0.205: C21.2 8.71,15.39 8.71,14.66 9.46,13.91 9.78,13.91 arc(9.87,13.95) 9.91,14.04 arc(9.94,14.13) 10.03,14.17 10.16,14.17 arc(10.25,14.13) 10.29,14.04 arc(10.32,13.95) 10.41,13.91 12.48,13.91 12.58,14.01 CN1.49
$1N31117: length 4.9
  Top Layer w0.205: CN1.35 12.58,10.51 12.48,10.61 11.52,10.61 11.2,10.28 9.61,10.28 C24.2
$1N31175: length 4.9
  Top Layer w0.205: CN1.37 12.58,11.01 12.48,10.91 11.39,10.91 11.07,10.59 9.51,10.59 C23.2
$1N48921: length 2.2
  Top Layer w0.762: R27.1 LED1.2
$1N58384: length 10.7
  Top Layer w0.508: v1(73.03,41.63) 73.93,41.63 C3.2 73.98,42.43 74.72,43.18 74.72,43.55 ; R1.1 78.46,44.47 v1(78.46,43.05)
  Bottom Layer w0.508: v1(78.46,43.05) 77.04,41.63 v1(73.03,41.63)

## Copper pours and planes (outline as drawn; the poured copper is in the pictures)
+1V on Top Layer: 28.22,50.71 31.62,50.71 32.06,50.28 32.06,48.67 31.93,48.55 29.88,48.55 28.22,50.2
+1V on Top Layer: 32.65,45.92 34.29,45.92 34.51,45.7 34.51,44.64 34.79,44.37 42.54,44.37 42.77,44.14 42.77,42.38 42.66,42.28 33.28,42.28 32.65,42.91
+1V on Top Layer: 78.05,36.86 78.21,36.7 78.21,33.55 77.44,32.79 67.84,32.79 67.49,33.15 67.49,36.4 67.94,36.86
+1V on Inner2: 75.23,36.83 75.23,33.08 68.93,26.79 20.07,26.79 13.65,33.21 13.65,36.16 14.68,37.19 14.68,38.84 15.15,39.31 15.77,39.31 15.94,39.14 15.94,35.88 18.57,33.25 28.16,33.25 30.16,35.24 30.16,35.85 29.68,36.33 29.68,36.92 29.86,37.1 32.01,37.1 34.15,39.24 34.15,45.88 31.55,48.48 30.09,48.48 29.82,48.75 29.82,49.81 30.03,50.02 42.53,50.02 42.69,49.87 42.69,35.37 44.22,33.87 64.89,33.87 67.95,36.89
+3.3V on Top Layer: 46.71,38.18 48.84,36.04 52.5,36.04 52.86,35.69 52.86,33.31 52.53,32.98 49.21,32.98 49.2,32.99 48.59,32.99 47.52,31.93 47.52,25.57 47.18,25.22 46.1,25.22 45.44,25.89 45.44,28.57 44.98,29.03 43.05,29.03 42.6,29.49 42.6,31.12 42.85,31.37 45.03,31.37 45.28,31.62 45.28,32.99 44.48,33.8 44.48,37.72 44.93,38.18
AVDD33 on Inner2: 21.76,49.83 25.49,49.83 26.06,49.26 26.06,45.35 24.61,43.91 21.97,43.91 19.36,41.3 19.36,35.66 20.46,34.57 27.15,34.57 28.81,36.23 29.61,36.23 30.09,35.74 30.09,35.35 28.13,33.39 18.63,33.39 16.1,35.91 16.1,39.26 15.27,40.09 15.27,43.34
AVDD33 on Inner2: 29.59,35.38 29.59,37.01 29.74,37.16 31.96,37.16 34.07,39.27 34.07,40.06 33.59,40.54 33.59,40.78 32,40.78 28.11,36.88 28.11,35.38
GND on Top Layer: -3.44,60.21 104.04,60.21 104.04,-4.31 -3.44,-4.31
GND on Bottom Layer: -2.01,57.73 102.12,57.73 102.12,-2.14 -2.01,-2.14
GND on Inner1: -5.2,61.57 106.33,61.57 106.33,-7.17 -5.2,-7.17
GND on Inner2: -8.12,64 109.09,64 109.09,-10.09 -8.12,-10.09
VDDREG on Top Layer: 32.14,48.95 38.36,48.95 38.36,46.91 32.14,46.91
LXO on Top Layer: 27.1,41.58 28.17,41.58 29.59,43 30.51,43 30.76,43.26 30.76,45.8 30.56,46 29.08,46 27.1,44.02
M.2+3.3V on Top Layer: 42.8,28.22 44.98,28.22 45.29,27.91 45.29,25.68 45.95,25.02 48.03,25.02 48.18,24.87 48.18,19.43 47.78,19.02 43.38,19.02 43.05,19.35 43.05,26.04 42.6,26.49 42.6,28.02
M.2+3.3V on Top Layer: 20.21,3.01 22.43,3.01 22.43,4.53 20.16,4.52 20.16,6.47 24.02,6.46 25.4,5.07 25.4,3.32 24.04,1.96 20.21,1.96
M.2+3.3V on Top Layer: 20.21,20.57 26.97,20.57 27.02,20.52 27.02,19.13 26.86,18.97 20.21,18.97
M.2+3.3V on Top Layer: 7.76,6.44 11.52,6.44 11.52,3.25 7.76,3.25
M.2+3.3V on Inner2: 20.63,6.93 21.46,7.76 21.46,20.19 23.29,22.02 40.56,22.02 43.05,24.51 47.62,24.51 48.29,23.85 48.29,17.25 44.88,13.84 28.78,13.84 27.56,12.62 27.56,5.26 24.16,1.85 7.8,1.85 6.78,2.87 6.78,6.43 7.29,6.93
USB5V on Top Layer: 68.55,54.23 68.55,45.14 66.93,43.51 59.47,43.51 58.8,44.18 56.25,44.18 56.06,44.37 56.06,45.11 56.38,45.43 60.52,45.43 61.09,46 65.1,46 65.96,46.86 65.96,50.06 65,51.03 65,54.23
USB5V on Top Layer: 76.16,45.43 79.09,45.43 79.37,45.72 79.37,46.8 78.87,47.3 77.4,47.3 77.31,47.39 77.31,54.49 76.99,54.8 74.07,54.8 73.77,54.5 73.77,52.67 75.33,51.11 75.33,49.33 75.63,49.03 75.63,45.95
USB5V on Top Layer: 6.93,45.95 7.39,45.95 7.39,43.49 8.42,42.46 8.42,41.01 7.76,41.01 6.68,42.09 6.68,43.41 6.93,43.66
USB5V on Top Layer: 36.19,53.33 38.37,53.33 38.37,49.88 36.19,49.88
USB5V on Top Layer: 5.41,43.97 5.41,40.56 4.95,40.11 3.53,40.11 3.53,41.88 4.5,42.85 4.5,43.56 4.9,43.97
USB5V on Bottom Layer: 4.41,45.97 4.91,45.97 4.92,45.96 4.92,43.93 5.18,43.66 5.18,40.38 4.92,40.11 4.53,40.11 3.57,41.07 3.57,42.58 4.42,43.43 4.42,45.96
USB5V on Bottom Layer: 6.91,45.96 7.42,45.96 7.42,43.27 8.4,42.29 8.4,41.03 7.78,41.03 7.76,41.02 6.4,42.38 6.4,43.54 6.91,44.05
USB5V on Inner2: 3.48,40.06 5.06,40.06 5.5,40.5 5.5,41.27 5.84,41.61 7.11,41.61 7.7,41.02 8.97,41.02 9.62,41.68 14.96,41.75 14.96,43.54 21.83,50.09 77.68,50.09 78.66,51.08 78.66,54.08 77.8,54.94 12.83,54.94 12.12,54.23 12.12,44.66 11.05,43.59 4.58,43.59 4.29,43.31 4.29,42.8 3.48,41.98 3.48,40.06
$1N4205 on Top Layer: 58.39,46.61 58.6,46.41 58.6,45.85 58.39,45.64 56.36,45.64 56.31,45.59 56.15,45.59 55.81,45.26 55.81,43.55 57.62,41.74 57.62,39.49 56.92,38.79 49.45,38.79 48.34,39.9 48.34,42.14 48.9,42.7 52.76,42.7 53.47,43.41 53.47,45.95 54.13,46.61
$1N5721 on Top Layer: 76.13,44.21 77.02,44.21 77.23,44 77.23,43.02 78.17,42.07 78.17,38.91 77.91,38.64 75.38,38.64 75.08,38.94 75.08,40.35 75.4,40.67 75.95,40.67 76.25,40.97 76.25,42.2 76.07,42.38 76.07,44.16

Small or netless copper shapes (teardrops, artwork), in the pictures only: 209 on Top Layer, 61 on Bottom Layer, 2 on Inner2

## Text on the board
Top Silkscreen Layer: 2230 | 2243 | 2260 | 2280
